# EAGLE design converter (EAGLE 9.0.0)
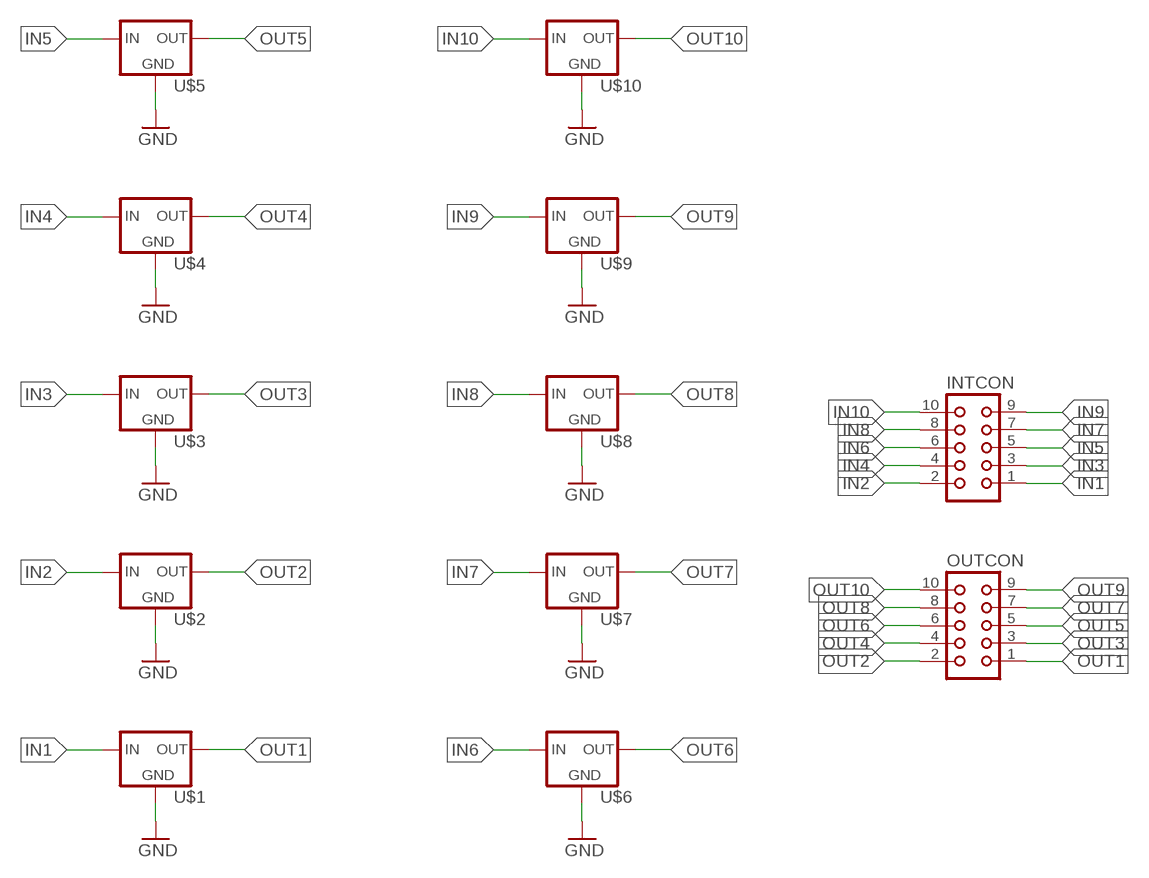
[diagram p0: schematic, sheet 1]

## Parts
INTCON  CON10  [CON10]
OUTCON  CON10  [CON10]
U$1  LOGIC_CONVERTERIC  [SOT223]
U$2  LOGIC_CONVERTERIC  [SOT223]
U$3  LOGIC_CONVERTERIC  [SOT223]
U$4  LOGIC_CONVERTERIC  [SOT223]
U$5  LOGIC_CONVERTERIC  [SOT223]
U$6  LOGIC_CONVERTERIC  [SOT223]
U$7  LOGIC_CONVERTERIC  [SOT223]
U$8  LOGIC_CONVERTERIC  [SOT223]
U$9  LOGIC_CONVERTERIC  [SOT223]
U$10  LOGIC_CONVERTERIC  [SOT223]

## Nets
GND: U$1.2(GND) U$1.3(GND) U$1.4(GND) U$1.GND U$2.2(GND) U$2.3(GND) U$2.4(GND) U$2.GND U$3.2(GND) U$3.3(GND) U$3.4(GND) U$3.GND U$4.2(GND) U$4.3(GND) U$4.4(GND) U$4.GND U$5.2(GND) U$5.3(GND) U$5.4(GND) U$5.GND U$6.2(GND) U$6.3(GND) U$6.4(GND) U$6.GND U$7.2(GND) U$7.3(GND) U$7.4(GND) U$7.GND U$8.2(GND) U$8.3(GND) U$8.4(GND) U$8.GND U$9.2(GND) U$9.3(GND) U$9.4(GND) U$9.GND U$10.2(GND) U$10.3(GND) U$10.4(GND) U$10.GND
IN1: INTCON.1 U$1.1(IN) U$1.IN
IN2: INTCON.2 U$2.1(IN) U$2.IN
IN3: INTCON.3 U$3.1(IN) U$3.IN
IN4: INTCON.4 U$4.1(IN) U$4.IN
IN5: INTCON.5 U$5.1(IN) U$5.IN
IN6: INTCON.6 U$6.1(IN) U$6.IN
IN7: INTCON.7 U$7.1(IN) U$7.IN
IN8: INTCON.8 U$8.1(IN) U$8.IN
IN9: INTCON.9 U$9.1(IN) U$9.IN
IN10: INTCON.10 U$10.1(IN) U$10.IN
OUT1: OUTCON.1 U$1.5(OUT) U$1.OUT
OUT2: OUTCON.2 U$2.5(OUT) U$2.OUT
OUT3: OUTCON.3 U$3.5(OUT) U$3.OUT
OUT4: OUTCON.4 U$4.5(OUT) U$4.OUT
OUT5: OUTCON.5 U$5.5(OUT) U$5.OUT
OUT6: OUTCON.6 U$6.5(OUT) U$6.OUT
OUT7: OUTCON.7 U$7.5(OUT) U$7.OUT
OUT8: OUTCON.8 U$8.5(OUT) U$8.OUT
OUT9: OUTCON.9 U$9.5(OUT) U$9.OUT
OUT10: OUTCON.10 U$10.5(OUT) U$10.OUT

## Library data of the parts
INTCON OUTCON = con-harting:CON10: CONNECTOR; OC_FARNELL: unknown; OC_NEWARK: unknown
U$1-U$10 = Modulo conversor:LOGIC_CONVERTER

## Board
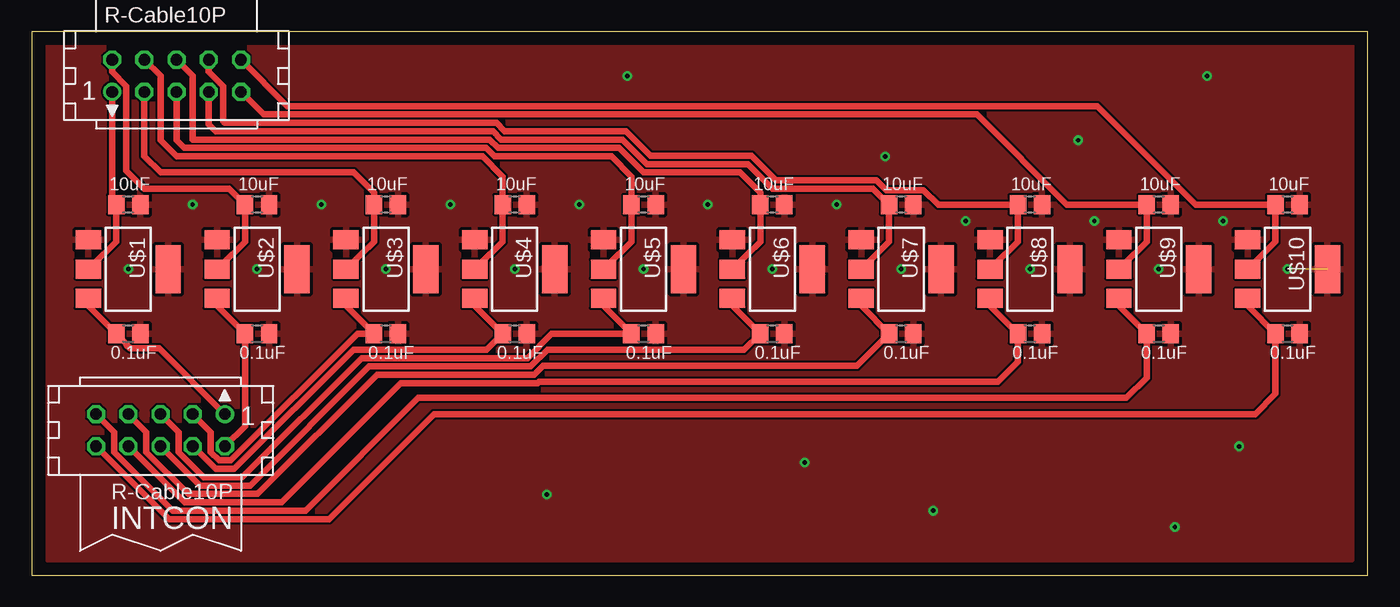
[diagram p1: board, top side]
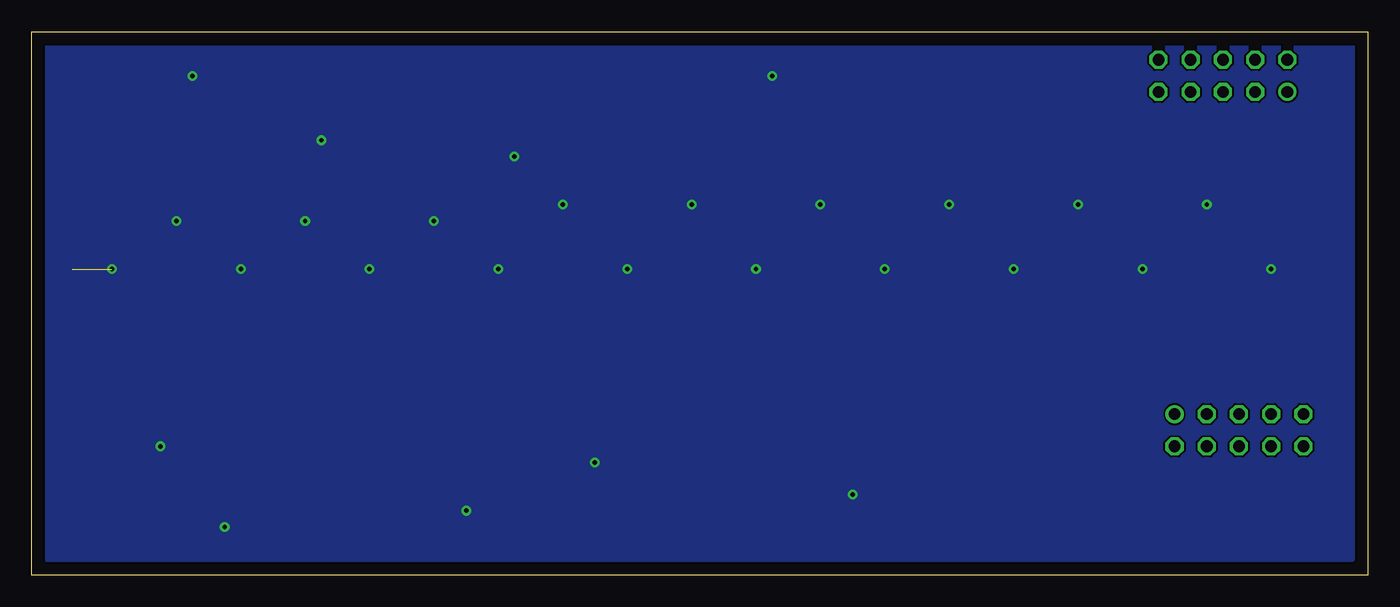
[diagram p2: board, bottom side, seen from below]

Size 105.39 x 42.85 mm. Coordinates in mm from the lower left corner, seen from the top.
Outline: 0,0 105.39,0 105.39,42.85 0,42.85 0,0
Copper layers (1*16): Top 0.035mm / dielectric 1.5mm / Bottom 0.035mm
Design rules "default": minimum track width 6mil, minimum drill 0.35mm, track to track 6mil, track to pad 6mil, pad to pad 6mil, via to via 6mil, smd to smd 6mil, copper to edge 40mil, drill to drill 6mil, minimum pad ring 10mil, minimum via ring 8mil, stop-mask expansion 4mil, vias tented up to drill 0mil, thermal gap 10mil

### Footprints (pad centres in the part's own frame; a part is rotated, then mirrored left to right if it is on the bottom)
CON10 = drill 0.914: 1 -5.08,-1.27 | drill 0.914 octagon: 2 -5.08,1.27; 3 -2.54,-1.27; 4 -2.54,1.27; 5 0,-1.27; 6 0,1.27; 7 2.54,-1.27; 8 2.54,1.27; 9 5.08,-1.27; 10 5.08,1.27
SOT223 = smd 1.3 x 1.5: 1 -0.95,0; 2 0.95,0; 3 0.95,10.16; 5 -0.95,10.16 | smd 2 x 3.8: 4 3.15,5.08 | smd 2 x 1.5: GND -3.15,7.38; IN -3.15,2.78; OUT -3.15,5.08

### Placement (x,y rotation side)
INTCON  10.16,11.43 180 top
OUTCON  11.43,39.37 0 top
U$1  7.62,19.05 0 top
U$2  17.78,19.05 0 top
U$3  27.94,19.05 0 top
U$4  38.1,19.05 0 top
U$5  48.26,19.05 0 top
U$6  58.42,19.05 0 top
U$7  68.58,19.05 0 top
U$8  78.74,19.05 0 top
U$9  88.9,19.05 0 top
U$10  99.06,19.05 0 top

### Tracks (layer width: path | path; a pad name or v marks a point on that pad's centre or on a via)
GND  (via drill 0.35)  (1 unrouted)
  other vias: 40.64,6.35 60.96,8.89 71.12,5.08 90.17,3.81 95.25,10.16 93.98,27.94 73.66,27.94 63.5,29.21 53.34,29.21 43.18,29.21 33.02,29.21 22.86,29.21 12.7,29.21 46.99,39.37 92.71,39.37 82.55,34.29 67.31,33.02 83.82,27.94 7.62,24.13 17.78,24.13 27.94,24.13 38.1,24.13 48.26,24.13 58.42,24.13 68.58,24.13 78.74,24.13 88.9,24.13 99.06,24.13
  pour Bottom: 1.27,41.91 1.27,1.27 104.14,1.27 104.14,41.91
  pour Top: 1.27,41.91 1.27,1.27 104.14,1.27 104.14,41.91
IN1
  Top 0.508: U$1.1 4.47,21.25 U$1.IN | 6.67,18.73 U$1.1 | INTCON.1 10.05,17.89 7.75,17.89 7.51,18.13 7.51,18.21 U$1.1
IN2
  Top 0.508: U$2.IN 14.63,21.25 U$2.1 16.83,11.75 INTCON.2
IN3
  Top 0.508: U$3.IN 24.79,21.25 U$3.1 25.71,19.05 15.7,9.04 14.78,9.04 14.12,9.7 14.12,11.28 INTCON.3
IN4
  Top 0.508: U$4.IN 34.95,21.25 U$4.1 35.88,17.78 25.37,17.78 15.98,8.38 14.5,8.38 12.73,10.16 INTCON.4
IN5
  Top 0.508: U$5.IN 45.11,21.25 U$5.1 41.02,19.05 39.09,17.12 26.01,17.12 16.61,7.72 13.56,7.72 11.58,9.7 11.58,11.28 INTCON.5
IN6
  Top 0.508: U$6.IN 55.27,21.25 U$6.1 56.2,17.78 40.69,17.78 39.37,16.46 26.62,16.46 17.22,7.06 13.28,7.06 10.19,10.16 INTCON.6
IN7
  Top 0.508: U$7.IN 65.43,21.25 U$7.1 65.09,16.51 40.35,16.51 39.64,15.8 27.23,15.8 17.83,6.4 12.34,6.4 9.04,9.7 9.04,11.28 INTCON.7
IN8
  Top 0.508: U$8.IN 75.59,21.25 U$8.1 77.79,16.83 76.2,15.24 40.02,15.24 39.91,15.14 29.11,15.14 19.71,5.74 12.07,5.74 7.65,10.16 INTCON.8
IN9
  Top 0.508: U$9.IN 85.75,21.25 U$9.1 87.95,15.56 86.36,13.97 30.48,13.97 21.59,5.08 11.12,5.08 6.5,9.7 6.5,11.28 INTCON.9
IN10
  Top 0.508: U$10.IN 95.91,21.25 U$10.1 98.11,14.29 96.52,12.7 31.75,12.7 23.47,4.42 10.85,4.42 5.11,10.16 INTCON.10
OUT1
  Top 0.508: U$1.OUT 5.61,25.27 5.64,25.27 6.67,26.3 U$1.5 6.35,29.53 OUTCON.1
OUT2
  Top 0.508: U$2.OUT 15.77,25.27 15.8,25.27 16.83,26.3 U$2.5 15.56,30.48 8.89,30.48 7.47,31.9 7.47,38.56 6.35,39.68 OUTCON.2
OUT3
  Top 0.508: U$3.OUT 25.93,25.27 25.96,25.27 26.99,26.3 U$3.5 26.99,30.16 25.4,31.75 10.16,31.75 8.89,33.02 OUTCON.3
OUT4
  Top 0.508: U$4.OUT 36.09,25.27 36.12,25.27 37.15,26.3 U$4.5 37.15,31.43 35.56,33.02 11.43,33.02 10.16,34.29 10.16,39.37 OUTCON.4
OUT5
  Top 0.508: U$5.OUT 46.25,25.27 46.28,25.27 47.31,26.3 U$5.5 47.31,31.43 45.72,33.02 36.49,33.02 35.83,33.68 12.04,33.68 11.43,34.29 OUTCON.5
OUT6
  Top 0.508: U$6.OUT 56.41,25.27 56.44,25.27 57.47,26.3 U$6.5 57.47,30.16 55.88,31.75 48.26,31.75 46.33,33.68 36.77,33.68 36.11,34.34 12.7,34.34 12.7,39.37 OUTCON.6
OUT7
  Top 0.508: U$7.OUT 66.57,25.27 66.6,25.27 67.63,26.3 U$7.5 66.36,30.48 58.42,30.48 56.49,32.41 48.53,32.41 46.6,34.34 37.04,34.34 36.38,35 14.53,35 13.97,35.56 OUTCON.7
OUT8
  Top 0.508: U$8.OUT 76.73,25.27 76.76,25.27 77.79,26.3 U$8.5 71.5,29.21 70.35,30.37 67.42,30.37 66.65,31.14 58.69,31.14 56.76,33.07 48.81,33.07 46.88,35 37.31,35 36.65,35.66 15.24,35.66 15.09,35.81 15.09,38.56 13.97,39.68 OUTCON.8
OUT9
  Top 0.508: U$9.OUT 86.89,25.27 86.92,25.27 87.95,26.3 U$9.5 81.66,29.21 74.55,36.32 18.29,36.32 OUTCON.9
OUT10
  Top 0.508: U$10.OUT 97.05,25.27 97.08,25.27 98.11,26.3 U$10.5 91.82,29.21 84.05,36.98 20.17,36.98 OUTCON.10